# Altium schematic sheet RC0603FR-0710KL1_RC0603FR-0710KL.schdoc
size 127 x 99 mm
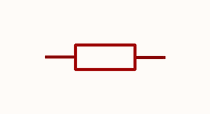
[diagram p0: RC0603FR-0710KL1_RC0603FR-0710KL.schdoc]

## Parts
R?  10kΩ  [R0603]  (value not drawn)

## Nets

Not connected (* = marked no-connect by the designer): R? 1 2

## Library data of the parts
R? = RC0603FR-0710KL: Manufacturer: YAGEO(国巨); Add into BOM: yes; Tolerance: ±1%; Temperature Coefficient: ±100ppm/℃; Symbol: RC0603FR-0710KL; Device: RC0603FR-0710KL; LCSC Part Name: 厚膜电阻 10kΩ ±1% 100mW; Supplier Part: C98220; Manufacturer Part: RC0603FR-0710KL; Supplier Footprint: 0603; JLCPCB Part Class: Extended Part; Datasheet: https://atta.szlcsc.com/upload/public/pdf/source/20180927/C295883_E8D83085EA81BD7DE0B2B681138C15EE.pdf; Supplier: LCSC; Convert to PCB: yes; Type: Thick Film Resistors; Value: 10kΩ; Operating Temperature Range: -55℃~+155℃